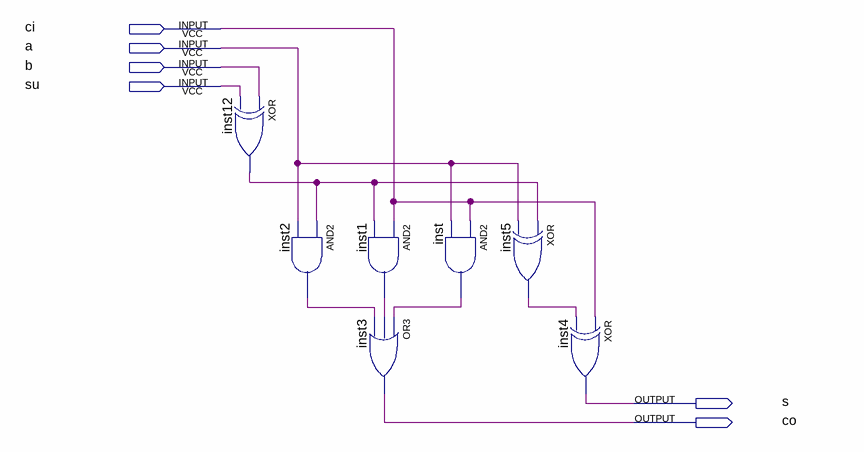
[diagram p0: schematic sheet]
// Quartus schematic jjdy.bdf as structural Verilog: 7 symbols, 6 pins
module jjdy (
  input  ci,
  input  a,
  input  b,
  input  su,
  output s,
  output co
);

  wire inst1_out, inst2_out, inst5_out, inst12_out, inst_out;

  xor inst12 (inst12_out, b, su);
  and inst2 (inst2_out, inst12_out, a);
  and inst1 (inst1_out, ci, inst12_out);
  or inst3 (co, inst_out, inst1_out, inst2_out);
  and inst (inst_out, ci, a);
  xor inst5 (inst5_out, inst12_out, a);
  xor inst4 (s, ci, inst5_out);
endmodule
